# Altium schematic sheet Convert12to5.SchDoc
size A4; Organization: Altium Limited; Address1: L3, 12a Rodborough Rd; Address2: Frenchs Forest; Address3: NSW; Address4: Australia 2086
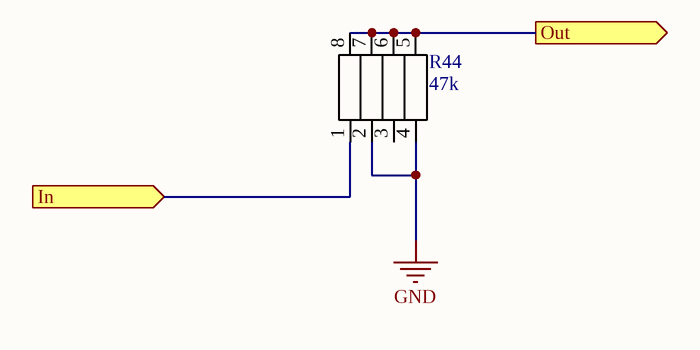
[diagram p0: Convert12to5.SchDoc]

## Parts
R44  47k  [YC164]

## Ports
In (in), Out (out)

## Nets
GND: R44.2 R44.4
In: R44.1 ; port In
Out: R44.5 R44.6 R44.7 R44.8 ; port Out

Not connected (* = marked no-connect by the designer): R44 3

## Notes on the sheet
- Title
- Size:
- Date:
- A4
- Number:
- Time:
- Revision:
- Sheet
- of
- File:

## Library data of the parts
R44 = YC164: YC164-JR-0747KL; value: 47k